# EasyEDA Pro project ProProject_魔方机器人7阶_2024-08-02.epro

# Schematic 树莓派gpio拓展版
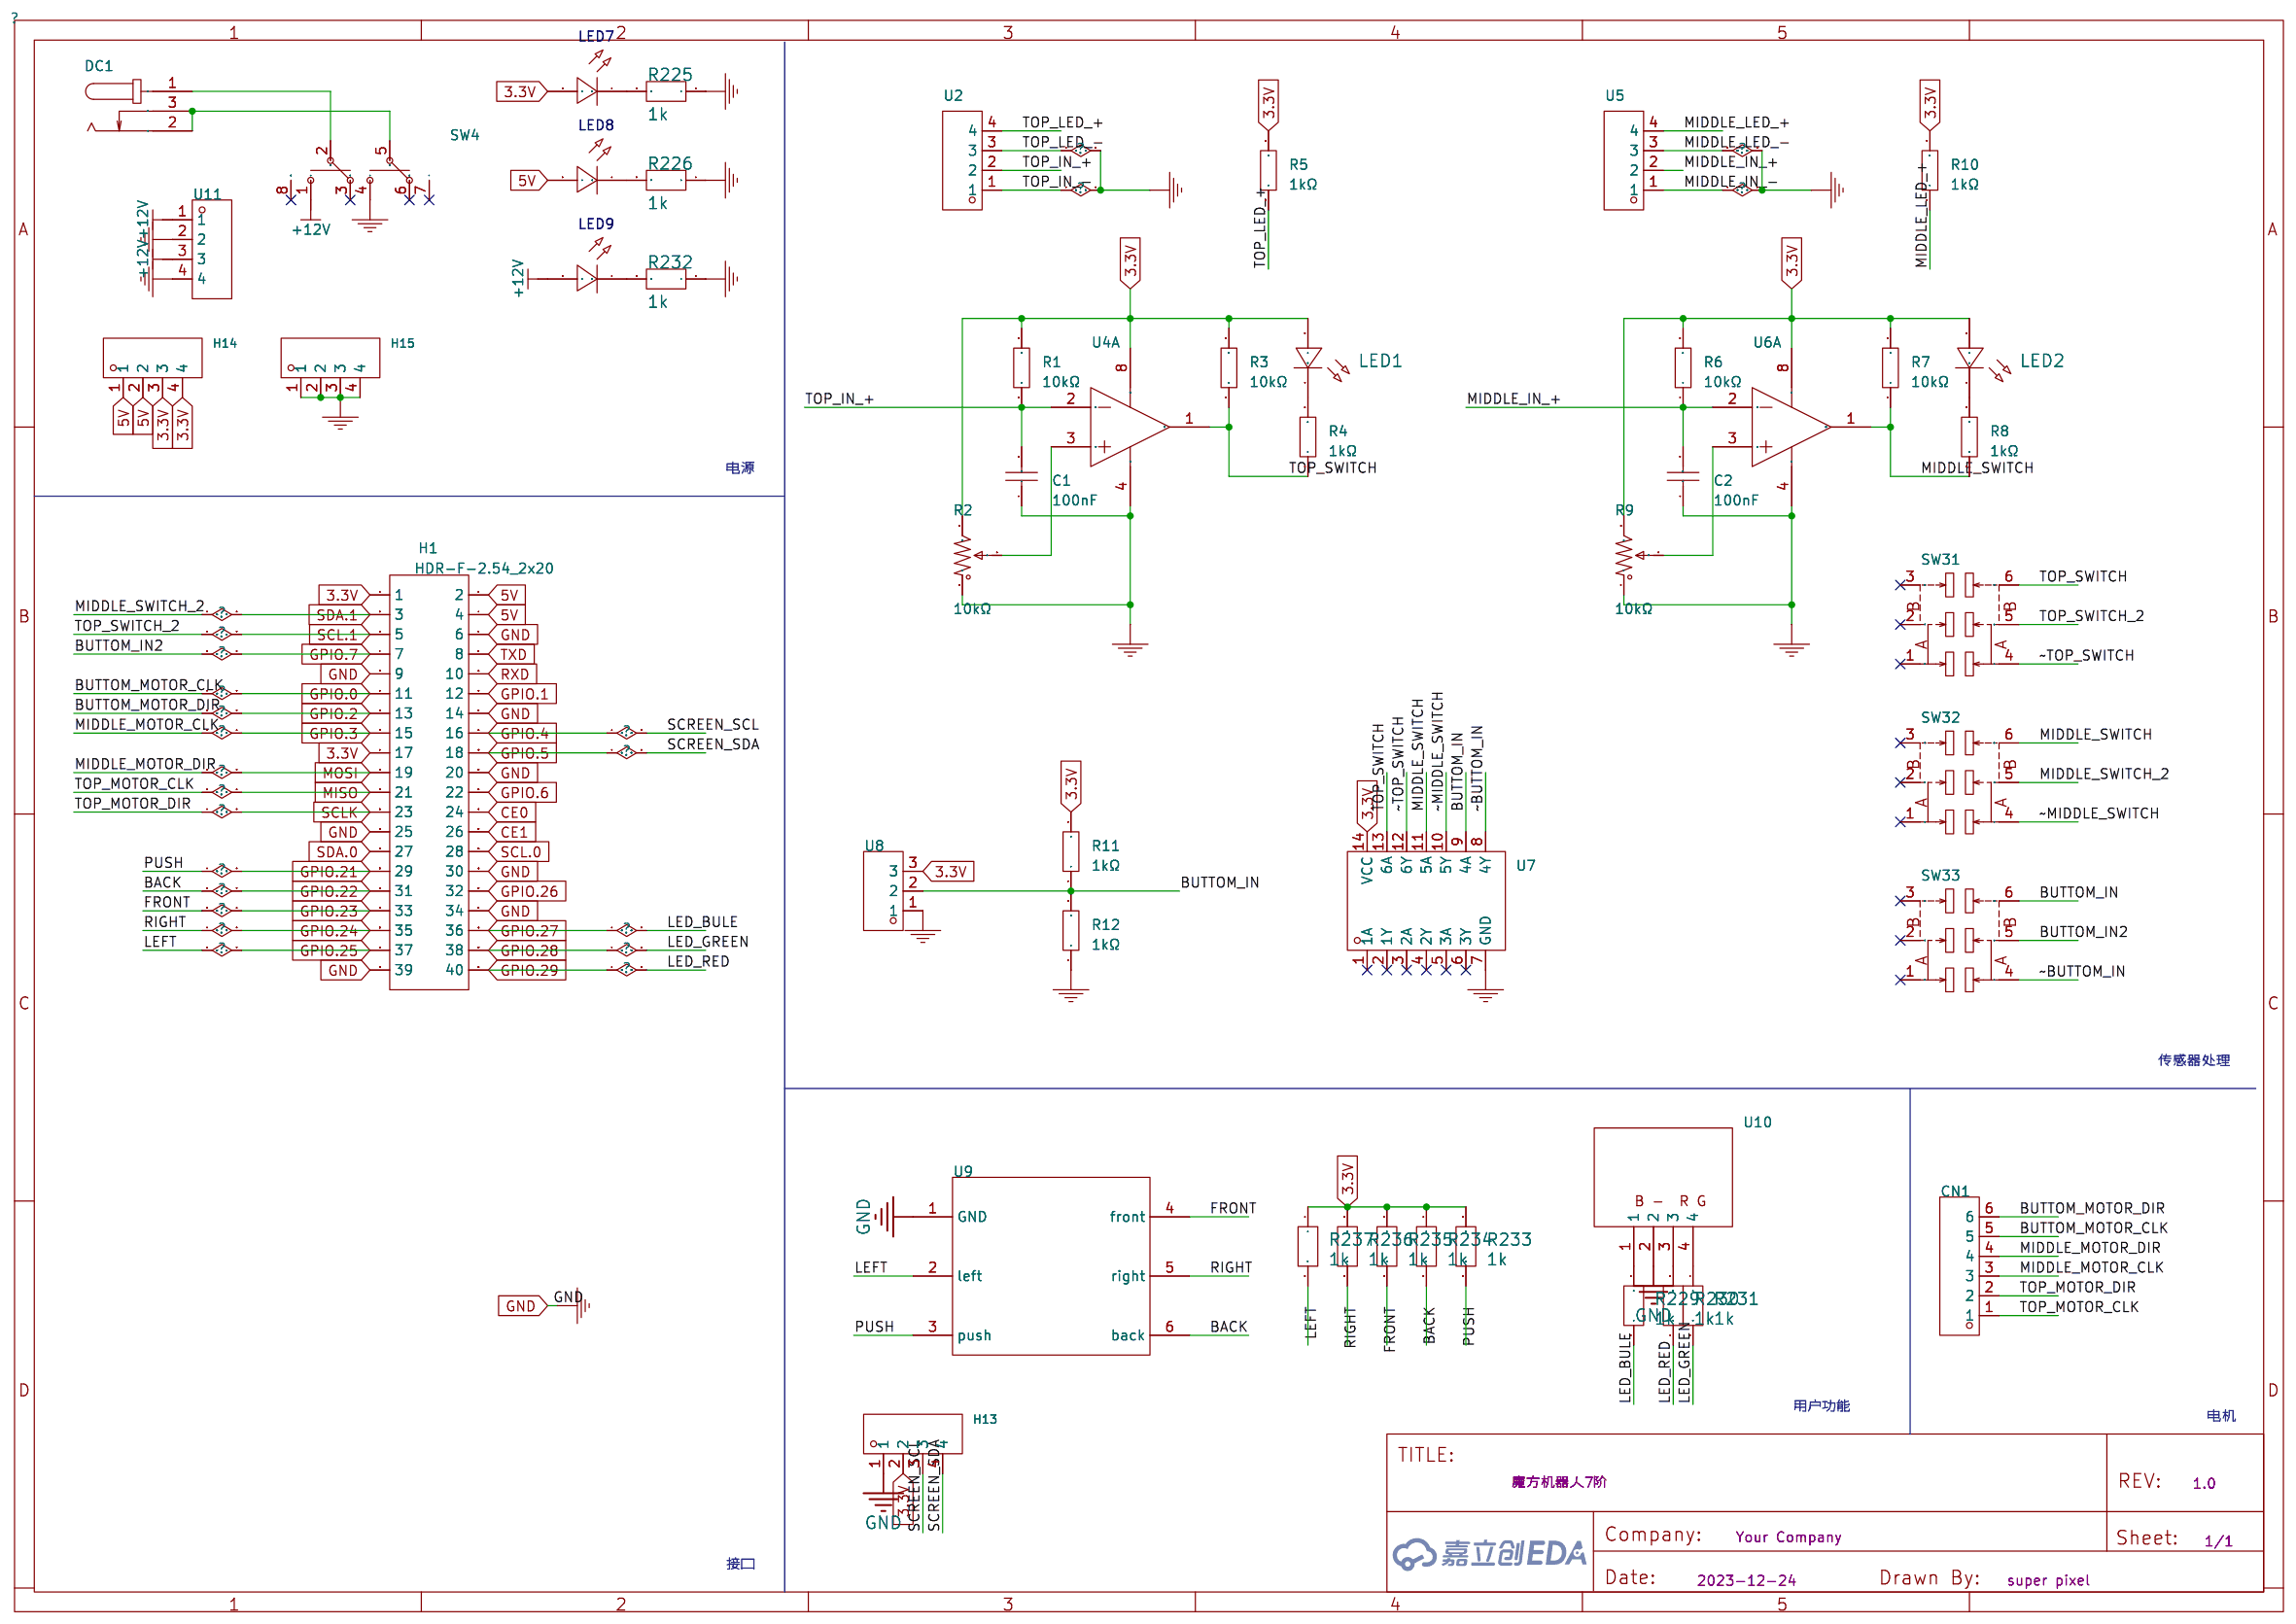
[diagram p0: schematic sheet]

## Parts
C1  100nF  [C0603]
C2  100nF  [C0603]
CN1  DB128V-5.08-6P-GN-S  [CONN-TH_6P-P5.08_DIBO_DB128V-5.08]
DC1  DC-005-5A-2.5  [DC-IN-TH_DC-005-5A-2.5]
H1  HDR-F-2.54_2x20  [HDR-F-2.54_2X20]
H13  -  [HDR-TH_4P-P2.54-V-M]
H14  -  [HDR-TH_4P-P2.54-V-M]
H15  -  [HDR-TH_4P-P2.54-V-M]
LED1  -  [LED_0603]
LED2  -  [LED_0603]
LED7  -  [LED_0805]
LED8  -  [LED_0805]
LED9  -  [LED_0805]
R1  10kΩ  [R0603]
R2  10kΩ  [RES-ADJ-TH_3362P]
R3  10kΩ  [R0603]
R4  1kΩ  [R0603]
R5  1kΩ  [R0603]
R6  10kΩ  [R0603]
R7  10kΩ  [R0603]
R8  1kΩ  [R0603]
R9  10kΩ  [RES-ADJ-TH_3362P]
R10  1kΩ  [R0603]
R11  1kΩ  [R0603]
R12  1kΩ  [R0603]
R225  1k  [R0805]
R226  1k  [R0805]
R229  1k  [R0805]
R230  1k  [R0805]
R231  1k  [R0805]
R232  1k  [R0805]
R233  1k  [R0805]
R234  1k  [R0805]
R235  1k  [R0805]
R236  1k  [R0805]
R237  1k  [R0805]
SW4  2MD3T2B1M6RES  [SW-TH_2MD3T2B1M6RES]
SW31  MST22D18G2  [SW-SMD_MST22D18G2]
SW32  MST22D18G2  [SW-SMD_MST22D18G2]
SW33  MST22D18G2  [SW-SMD_MST22D18G2]
U2  DB127V-5.0-4P-GN-S  [CONN-TH_4P-P5.00_DB127V-5.0-4P-GN-S]
U4  LM358  [SOP-8_L4.9-W3.9-P1.27-LS6.0-BL]  (section 1)
U5  DB127V-5.0-4P-GN-S  [CONN-TH_4P-P5.00_DB127V-5.0-4P-GN-S]
U6  LM358  [SOP-8_L4.9-W3.9-P1.27-LS6.0-BL]  (section 1)
U7  XL74LS04  [SOP-14_L8.6-W3.9-P1.27-LS6.0-BL]
U8  XY128V-A-5.08-3P  [CONN-TH_XY128V-A-5.08-3P]
U9  -  [直插五向开关]
U10  -  [直插rgb]
U11  DB127V-5.0-4P-GN-S  [CONN-TH_4P-P5.00_DB127V-5.0-4P-GN-S]

## Library data of the parts
C1 C2 = 0603B104K500NT: 容值:100nF;精度:±10%;额定电压:50V;材质(温度系数):X7R;; LCSC Part Name: 100nF ±10% 50V; Supplier Part: C30926; Manufacturer: FH(风华); Supplier Footprint: 0603; JLCPCB Part Class: 扩展库; Datasheet: https://atta.szlcsc.com/upload/public/pdf/source/20200305/C486355_26A10D38EF8C2A5C37091D0039909270.pdf; Supplier: LCSC; Tolerance: ±10%; Voltage Rated: 50V; Temperature Coefficient: X7R
CN1 = DB128V-5.08-6P-GN-S: 间距:5.08mm;结构:1x6P;安装方式:直插;排数:1;额定电流:20A;额定电压:300V;线规 - AWG:12~30;线规 - mm2:2.5;工作温度范围:-40℃~+105℃;颜色:绿色;每排PIN数:6;; LCSC Part Name: 5.08mm 1x6P 排数:1 每排P数:6 直插; Supplier Part: C2915642; Manufacturer: DORABO(地博电气); Supplier Footprint: 插件,P=5.08mm; JLCPCB Part Class: 扩展库; Datasheet: https://atta.szlcsc.com/upload/public/pdf/source/20230106/CC449C10514519CDCE20F1C37DBF2DAC.pdf; Supplier: LCSC; Pitch: 5.08mm; Structure: 1x6P; Mounting Style: 直插; Number of Pins: 6P; Number of Rows: 1; Current Rating (Max): 20A; Voltage Rating (Max): 300V; Wire Gauge - AWG: 12~30; Wire Gauge - mm2: 2.5; Operating Temperature Range: -40℃~+105℃; Color: 绿色; Number of PINs Per Row: 6
DC1 = DC-005-5A-2.5: 连接器类型:DC电源插座;触点内径:2.5mm;触点外径:6.5mm;额定电流:5A;额定电压:24V;触头材质:黄铜;工作温度范围:-20℃~+70℃;焊接温度(最大值):260℃;; LCSC Part Name: DC电源插座 内径:2.5mm 外径:6.5mm; Supplier Part: C381115; Manufacturer: XKB Connectivity(中国星坤); Supplier Footprint: 插件; JLCPCB Part Class: 扩展库; Datasheet: https://atta.szlcsc.com/upload/public/pdf/source/20220930/9F6B678D272419D8FE16D336E354A545.pdf; Supplier: LCSC; Connector Type: DC电源插座; Inside Contact Diameter: 2.5mm; Outside Contact Diameter: 6.5mm; Current Rating (Max): 5A; Voltage Rating (Max): 24V; Contact Material: 黄铜; Operating Temperature Range: -20℃~+70℃; Welding Temperature (Max): 260℃
H1 = HDR-F-2.54_2x20: Supplier Part: C50982; Supplier: LCSC
H13-H15 = HDR-M_2.54_1x4P: Supplier Part: C492403; Supplier Footprint: 插件
LED1 LED2 = LED_0603-R: Supplier Footprint: 0603
LED7-LED9 = LED_0805-G: Supplier Footprint: 0805
R1 R3 R6 R7 = 0603WAF1002T5E: 阻值:10kΩ;精度:±1%;功率:100mW;温度系数:±100ppm/℃;电阻类型:厚膜电阻;; LCSC Part Name: 10kΩ ±1% 100mW 厚膜电阻; Supplier Part: C25804; Manufacturer: UNI-ROYAL(厚声); Supplier Footprint: 0603; JLCPCB Part Class: Basic Part; Datasheet: https://atta.szlcsc.com/upload/public/pdf/source/20200306/C422600_1E6D84923E4A46A82E41ADD87F860B5C.pdf; Supplier: LCSC; Tolerance: ±1%; Power(Watts): 100mW; Overload Voltage (Max): 75V; Temperature Coefficient: ±100ppm/℃; Type: 厚膜电阻; Operating Temperature Range: -55℃~+155℃
R2 R9 = 3362P-1-103: 阻值:10kΩ;精度:±10%;; LCSC Part Name: 10kΩ ±10%; Supplier Part: C118956; Manufacturer: BOCHEN(博晨); Supplier Footprint: 插件; JLCPCB Part Class: 扩展库; Datasheet: https://atta.szlcsc.com/upload/public/pdf/source/20171114/C118956_15106326650691117445.pdf; Supplier: LCSC; Tolerance: ±10%
R4 R5 R8 R10-R12 = 0603WAF1001T5E: 阻值:1kΩ;精度:±1%;功率:100mW;温度系数:±100ppm/℃;电阻类型:厚膜电阻;; LCSC Part Name: 1kΩ ±1% 100mW 厚膜电阻; Supplier Part: C21190; Manufacturer: UNI-ROYAL(厚声); Supplier Footprint: 0603; JLCPCB Part Class: Basic Part; Datasheet: https://atta.szlcsc.com/upload/public/pdf/source/20200306/C422600_1E6D84923E4A46A82E41ADD87F860B5C.pdf; Supplier: LCSC; Tolerance: ±1%; Power(Watts): 100mW; Overload Voltage (Max): 75V; Temperature Coefficient: ±100ppm/℃; Type: 厚膜电阻; Operating Temperature Range: -55℃~+155℃
R225 R226 R229-R237 = 1k
SW4 = 2MD3T2B1M6RES: 电路结构:双刀双掷;机械寿命:30000;钮柄形状:圆柱钮柄;引脚样式:PC引脚;安装方式:弯插;工作温度:-40℃~+85℃;; LCSC Part Name: 2M系列 钮子开关 摇头开关; Supplier Part: C545196; Manufacturer: Dailywell(德利威); Supplier Footprint: 插件; JLCPCB Part Class: Extended Part; Datasheet: https://atta.szlcsc.com/upload/public/pdf/source/20200324/C496170_954A7394085DEA4CF4EC9443DF401EBE.pdf; Supplier: LCSC; Circuit: 双刀双掷; Mechanical Life: 30000; Actuator Type: 圆柱钮柄; Pin Style: PC引脚; Mounting Style: 弯插; Operating Temperature: -40℃~+85℃
SW31-SW33 = MST22D18G2: 额定电流(DC)：50mA 额定电压(DC)：12V 电路结构：单刀双掷 安装方式：立贴 机械寿命：10000 滑钮形状：矩形柱状 引脚样式：SMD接片 工作温度：-30℃~+80℃ 开关长度：9.1mm 开关宽度：3.6mm 开关高度：3.45mm 柄高：2mm; LCSC Part Name: 两档立式贴片 6脚拨动 柄长2.0MM; Supplier Part: C431544; Manufacturer: SHOU HAN(首韩); Supplier Footprint: SMD,3.6x9.1mm; JLCPCB Part Class: 扩展库; Datasheet: https://atta.szlcsc.com/upload/public/pdf/source/20190925/C431544_D32DFFD935A96A6C5145903882D4ABA1.pdf; Supplier: LCSC
U2 U5 U11 = DB127V-5.0-4P-GN-S: 间距:5mm;结构:1x4P;排数:1;每排PIN数:4;安装方式:直插;额定电流:15A;额定电压:250V;线规 - AWG:14~26;线规 - mm2:1.5;工作温度范围:-40℃~+105℃;颜色:绿色;; LCSC Part Name: 5mm 1x4P 排数:1 每排P数:4 直插; Supplier Part: C430624; Manufacturer: DIBO(地博电气); Supplier Footprint: 插件,P=5mm; JLCPCB Part Class: 扩展库; Datasheet: https://atta.szlcsc.com/upload/public/pdf/source/20230106/9CDB472D403F670588C42D375AEF1B30.pdf; Supplier: LCSC; Pitch: 5mm; Structure: 1x4P; Number of Rows: 1; Number of PINs Per Row: 4; Mounting Style: 直插; Current Rating (Max): 15A; Voltage Rating (Max): 250V; Wire Gauge - AWG: 14~26; Wire Gauge - mm2: 1.5; Operating Temperature Range: -40℃~+105℃; Color: 绿色; Number of Pins: 4P
U4 U6 = LM358_C5252902: 放大器数:双路;输入失调电压(Vos):5mV;输入偏置电流(Ib):50nA;增益带宽积(GBP):1.2MHz;; LCSC Part Name: 增益带宽(GBP):1.2MHz VIO:5mV  LM358; Supplier Part: C5252902; Manufacturer: MSKSEMI(美森科); Supplier Footprint: SOP-8; JLCPCB Part Class: Extended Part; Datasheet: https://atta.szlcsc.com/upload/public/pdf/source/20221111/EFA130B3B4599AE68A453AC9B85C4BC9.pdf; Supplier: LCSC; Number of Circuits: 双路; Supply Voltage: 3V~36V; Voltage - Input Offset(Vos): 5mV; Current - Input Bias(Ib): 50nA; Gain Bandwidth Product(GBP): 1.2MHz; Common Mode Rejection Ratio (CMRR): 80dB; Supply Current: 300uA; Operating Temperature: 0℃~+70℃
U7 = XL74LS04: 六路反向器; LCSC Part Name: 变换器; Supplier Part: C513511; Manufacturer: XINLUDA(信路达); Supplier Footprint: SOP-14; JLCPCB Part Class: Extended Part; Datasheet: https://atta.szlcsc.com/upload/public/pdf/source/20200414/C513511_4295B1BB66C5B6360CE522C95F4B27FF.pdf; Supplier: LCSC
U8 = XY128V-A-5.08-3P: 结构:1x3P;间距:5.08mm;颜色:绿色;安装方式:直插;额定电流:15A;额定电压:300V;排数:1;线规 - AWG:12~24;线规 - 平方毫米:2.5;每排PIN数:3;工作温度范围:-;; LCSC Part Name: 5.08mm 1x3P 排数:1 每排P数:3 直插; Supplier Part: C557666; Manufacturer: XINLAIYA(新莱亚); Supplier Footprint: 插件,P=5.08mm; JLCPCB Part Class: Extended Part; Datasheet: https://atta.szlcsc.com/upload/public/pdf/source/20200527/C557663_965673E12F0DA50AFE0C050081E55359.pdf; Supplier: LCSC; Structure: 1x3P; Pitch: 5.08mm; Color: 绿色; Mounting Style: 直插; Current Rating (Max): 15A; Voltage Rating (Max): 300V; Number of Pins: 3P; Number of Rows: 1; Wire Gauge - AWG: 12~24; Wire Gauge - mm2: 2.5; Number of PINs Per Row: 3
U9 = 直插五向开关
U10 = 直插RGB

## Nets
3.3V: H1.1 H1.17 H13.2 H14.3 H14.4 LED1.2(A) LED2.2(A) LED7.2(A) R1.2 R2.3 R3.2 R5.2 R6.2 R7.2 R9.3 R10.2 R11.2 R233.1 R234.1 R235.1 R236.1 R237.1 U4.8(VCC) U6.8(VCC) U7.14(VCC) U8.3
5V: H1.2 H1.4 H14.1 H14.2 LED8.2(A)
+12V: LED9.2(A) SW4.1 U11.1 U11.3
GND: C1.1 C2.1 H1.6 H1.9 H1.14 H1.20 H1.25 H1.30 H1.34 H1.39 H13.1 H15.1 H15.2 H15.3 H15.4 R2.1 R9.1 R12.1 R225.1 R226.1 R232.1 SW4.4 U2.1 U2.3 U4.4(VEE) U5.1 U5.3 U6.4(VEE) U7.7(GND) U8.1 U9.1(GND) U10.2 U11.2 U11.4
BACK: H1.31 R234.2 U9.6(back)
BUTTOM_IN: R11.1 R12.2 SW33.6 U7.9(4A) U8.2
BUTTOM_IN2: H1.7 SW33.5
BUTTOM_MOTOR_CLK: CN1.5 H1.11
BUTTOM_MOTOR_DIR: CN1.6 H1.13
CE0: H1.24
CE1: H1.26
FRONT: H1.33 R235.2 U9.4(front)
GPIO.1: H1.12
GPIO.3: CN1.3 H1.15
GPIO.4: H1.16 H13.3
GPIO.5: H1.18 H13.4
GPIO.6: H1.22
GPIO.21: H1.29 R233.2 U9.3(push)
GPIO.24: H1.35 R236.2 U9.5(right)
GPIO.25: H1.37 R237.2 U9.2(left)
GPIO.26: H1.32
GPIO.27: H1.36 R229.1
GPIO.28: H1.38 R231.2
GPIO.29: H1.40 R230.1
MIDDLE_IN_+: C2.2 R6.1 U5.2 U6.2(IN1-)
MIDDLE_LED_+: R10.1 U5.4
MIDDLE_MOTOR_DIR: CN1.4 H1.19
MIDDLE_SWITCH: R7.1 R8.1 SW32.6 U6.1(OUT1) U7.11(5A)
MIDDLE_SWITCH_2: H1.3 SW32.5
MISO: CN1.1 H1.21
RXD: H1.10
SCL.0: H1.28
SCL.1: H1.5 SW31.5
SCLK: CN1.2 H1.23
SDA.0: H1.27
TOP_IN_+: C1.2 R1.1 U2.2 U4.2(IN1-)
TOP_LED_+: R5.1 U2.4
TOP_SWITCH: R3.1 R4.1 SW31.6 U4.1(OUT1) U7.13(6A)
TXD: H1.8
~BUTTOM_IN: SW33.4 U7.8(4Y)
~MIDDLE_SWITCH: SW32.4 U7.10(5Y)
~TOP_SWITCH: SW31.4 U7.12(6Y)
$1N2898: LED1.1(C) R4.2
$1N2946: R2.2 U4.3(IN1+)
$1N3443: LED2.1(C) R8.2
$1N3463: R9.2 U6.3(IN1+)
$1N4495: DC1.1 SW4.2
$1N4496: DC1.2 DC1.3 SW4.5
$1N4628: LED7.1(C) R225.2
$1N4630: LED8.1(C) R226.2
$1N4991: R229.2 U10.1
$1N4992: R230.2 U10.3
$1N4993: R231.1 U10.4
$1N5070: LED9.1(C) R232.2

Not connected (* = marked no-connect by the designer): SW4 3* 6* 7* 8*; SW31 1* 2* 3*; SW32 1* 2* 3*; SW33 1* 2* 3*; U7 1(1A)* 2(1Y)* 3(2A)* 4(2Y)* 5(3A)* 6(3Y)*

## Notes on the sheet
- 电源
- 传感器处理
- 用户功能
- 电机
- 接口

# Board 1-PCB_NEW_PCB
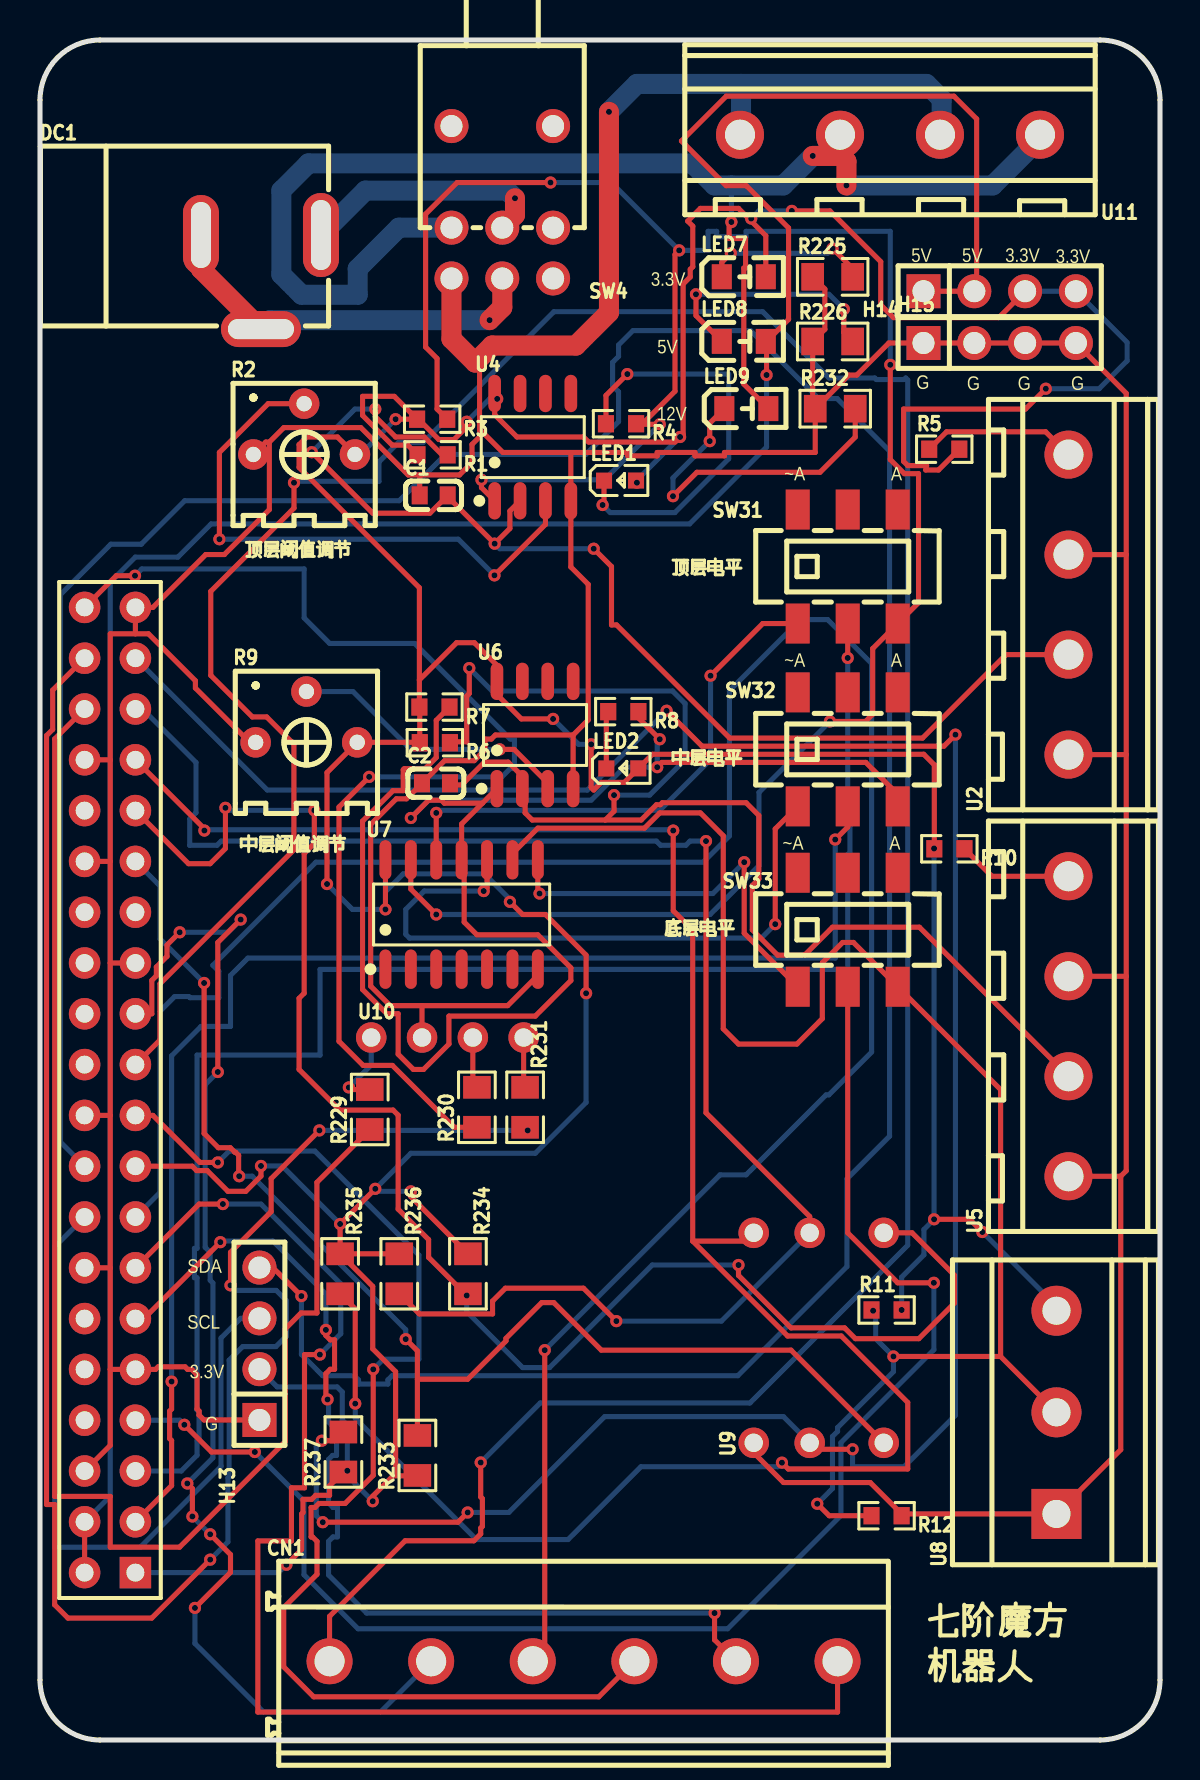
[diagram p1: board, top side]
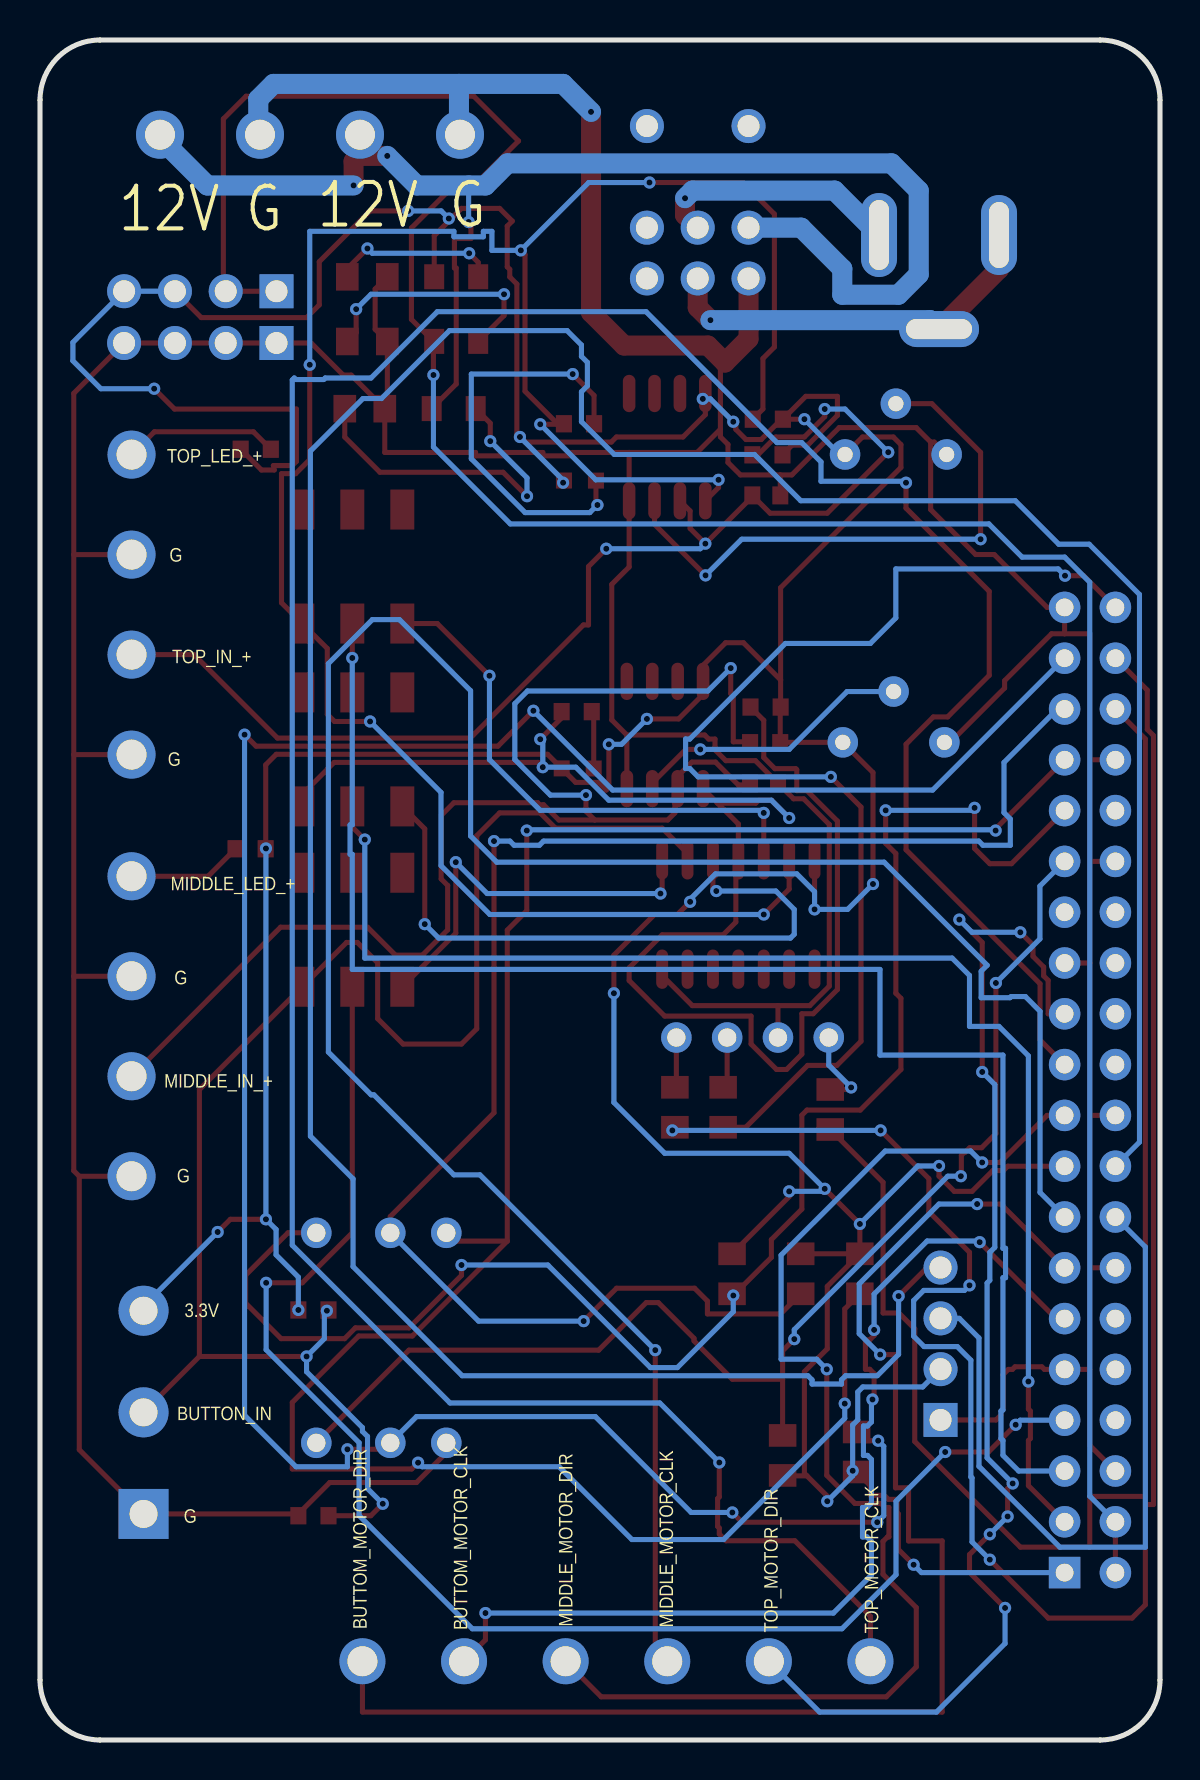
[diagram p2: board, bottom side, seen from below]

Outline 56 x 85 mm; copper layers: Top Layer, Bottom Layer. Coordinates in mm from the lower left corner of the outline.
Outline path: 0,82 arc(0.88,84.12) 3,85 53,85 arc(55.12,84.12) 56,82 56,3 arc(55.12,0.88) 53,0 3,0 arc(0.88,0.88) 0,3 0,82
Stack: Top Layer 0.035mm / Dielectric1 1.51mm FR4 er 4.5 / Bottom Layer 0.035mm

## Design rules (mm)
spacing Default (default): track to track 0.152, other pairs 0 to 0.152
track width Default (default): min 0.254, default 0.254, max 25.4
differential pair differentialPair (default): width min 0.127, default 0.254, max 2.54; gap min 0.152, default 0.152
via Default (default): diameter min 0.61, default 0.61, max 100.025; hole min 0.305, default 0.305, max 59.995

## Placement (name value [footprint] x y rotation side)
C1  100nF  [C0603]  19.69 62.23 0 top
C2  100nF  [C0603]  19.8 47.84 0 top
CN1  DB128V-5.08-6P-GN-S  [CONN-TH_6P-P5.08_DIBO_DB128V-5.08]  27.18 3.94 0 top
DC1  DC-005-5A-2.5  [DC-IN-TH_DC-005-5A-2.5]  11.05 72.9 0 top
H1  HDR-F-2.54_2x20  [HDR-F-2.54_2X20]  3.5 32.5 90 top
H13  -  [HDR-TH_4P-P2.54-V-M]  10.97 19.81 90 top
H14  -  [HDR-TH_4P-P2.54-V-M]  47.99 72.44 0 top
H15  -  [HDR-TH_4P-P2.54-V-M]  47.99 69.85 0 top
LED1  -  [LED_0603]  29.05 62.98 0 top
LED2  -  [LED_0603]  29.17 48.58 0 top
LED7  -  [LED_0805]  35.24 73.16 0 top
LED8  -  [LED_0805]  35.24 69.93 0 top
LED9  -  [LED_0805]  35.37 66.57 0 top
R1  10kΩ  [R0603]  19.63 64.26 180 top
R2  10kΩ  [RES-ADJ-TH_3362P]  13.21 65.55 0 top
R3  10kΩ  [R0603]  19.61 66.04 180 top
R4  1kΩ  [R0603]  29.05 65.81 180 top
R5  1kΩ  [R0603]  45.21 64.54 0 top
R6  10kΩ  [R0603]  19.74 49.86 180 top
R7  10kΩ  [R0603]  19.72 51.65 180 top
R8  1kΩ  [R0603]  29.16 51.42 180 top
R9  10kΩ  [RES-ADJ-TH_3362P]  13.32 51.15 0 top
R10  1kΩ  [R0603]  45.47 44.56 180 top
R11  1kΩ  [R0603]  42.33 21.5 0 top
R12  1kΩ  [R0603]  42.33 11.21 180 top
R225  1k  [R0805]  39.63 73.16 0 top
R226  1k  [R0805]  39.63 69.93 0 top
R229  1k  [R0805]  16.49 31.52 90 top
R230  1k  [R0805]  21.84 31.64 90 top
R231  1k  [R0805]  24.26 31.64 270 top
R232  1k  [R0805]  39.76 66.57 0 top
R233  1k  [R0805]  18.87 14.23 90 top
R234  1k  [R0805]  21.4 23.31 270 top
R235  1k  [R0805]  15.01 23.31 270 top
R236  1k  [R0805]  17.96 23.31 270 top
R237  1k  [R0805]  15.17 14.4 90 top
SW4  2MD3T2B1M6RES  [SW-TH_2MD3T2B1M6RES]  23.11 76.89 180 top
SW31  MST22D18G2  [SW-SMD_MST22D18G2]  40.39 58.67 0 top
SW32  MST22D18G2  [SW-SMD_MST22D18G2]  40.39 49.53 0 top
SW33  MST22D18G2  [SW-SMD_MST22D18G2]  40.39 40.51 0 top
U2  DB127V-5.0-4P-GN-S  [CONN-TH_4P-P5.00_DB127V-5.0-4P-GN-S]  51.42 56.77 90 top
U4  LM358  [SOP-8_L4.9-W3.9-P1.27-LS6.0-BL]  24.64 64.64 0 top
U5  DB127V-5.0-4P-GN-S  [CONN-TH_4P-P5.00_DB127V-5.0-4P-GN-S]  51.42 35.69 90 top
U6  LM358  [SOP-8_L4.9-W3.9-P1.27-LS6.0-BL]  24.75 50.25 0 top
U7  XL74LS04  [SOP-14_L8.6-W3.9-P1.27-LS6.0-BL]  21.08 41.28 0 top
U8  XY128V-A-5.08-3P  [CONN-TH_XY128V-A-5.08-3P]  50.82 16.38 90 top
U9  -  [直插五向开关]  35.69 14.86 90 top
U10  -  [直插rgb]  16.56 35.12 0 top
U11  DB127V-5.0-4P-GN-S  [CONN-TH_4P-P5.00_DB127V-5.0-4P-GN-S]  42.5 80.26 180 top

## Footprints (pads in the part's own frame, mm; a bottom-side part is the same pattern mirrored in y, then rotated)
C0603
  rect 0.8x0.9 smd: 1(-0.7,0) 2(0.7,0)
CONN-TH_4P-P5.00_DB127V-5.0-4P-GN-S
  round 2.4 hole 1.5: 1(-7.5,0) 2(-2.5,0) 3(2.5,0) 4(7.5,0)
CONN-TH_6P-P5.08_DIBO_DB128V-5.08
  round 2.3 hole 1.5: 1(-12.7,0) 2(-7.62,0) 3(-2.54,0) 4(2.54,0) 5(7.62,0) 6(12.7,0)
CONN-TH_XY128V-A-5.08-3P
  rect 2.5x2.5 hole 1.4: 1(-5.08,0)
  round 2.5 hole 1.4: 2(0,0) 3(5.08,0)
DC-IN-TH_DC-005-5A-2.5
  oval 1.8x4.2 hole 1x3.5: 1(3,2.352)
  oval 1.8x4 hole 1x3.3: 2(-3,2.352)
  oval 4x1.8 hole 3.3x1: 3(-0.001,-2.352)
HDR-F-2.54_2X20
  rect 1.575x1.575 hole 0.889: 1(-24.13,-1.27)
  round 1.575 hole 0.889: 2(-24.13,1.27) 3(-21.59,-1.27) 4(-21.59,1.27) 5(-19.05,-1.27) 6(-19.05,1.27) 7(-16.51,-1.27) 8(-16.51,1.27) 9(-13.97,-1.27) 10(-13.97,1.27) 11(-11.43,-1.27) 12(-11.43,1.27) 13(-8.89,-1.27) 14(-8.89,1.27) 15(-6.35,-1.27) 16(-6.35,1.27) 17(-3.81,-1.27) 18(-3.81,1.27) 19(-1.27,-1.27) 20(-1.27,1.27) 21(1.27,-1.27) 22(1.27,1.27) 23(3.81,-1.27) 24(3.81,1.27) 25(6.35,-1.27) 26(6.35,1.27) 27(8.89,-1.27) 28(8.89,1.27) 29(11.43,-1.27) 30(11.43,1.27) 31(13.97,-1.27) 32(13.97,1.27) 33(16.51,-1.27) 34(16.51,1.27) 35(19.05,-1.27) 36(19.05,1.27) 37(21.59,-1.27) 38(21.59,1.27) 39(24.13,-1.27) 40(24.13,1.27)
HDR-TH_4P-P2.54-V-M
  rect 1.7x1.7 hole 1.1: 1(-3.81,0)
  round 1.7 hole 1.1: 2(-1.27,0) 3(1.27,0) 4(3.81,0)
LED_0603
  rect 0.8x0.8 smd: 1(-0.851,-0.01) 2(0.75,-0.005)
LED_0805
  rect 1x1.25 smd: 1(-1.15,0.005) 2(1.05,0.005)
R0603
  rect 0.806x0.864 smd: 1(-0.753,0) 2(0.753,0)
R0805
  rect 1.133x1.377 smd: 1(-1,0) 2(1,0)
RES-ADJ-TH_3362P
  round 1.524 hole 0.762: 1(-2.54,-1.27) 2(0,1.27) 3(2.54,-1.27)
SOP-8_L4.9-W3.9-P1.27-LS6.0-BL
  oval 0.63x1.865 smd: 1(-1.905,-2.683) 2(-0.635,-2.683) 3(0.635,-2.683) 4(1.905,-2.683) 5(1.905,2.683) 6(0.635,2.683) 7(-0.635,2.683) 8(-1.905,2.683)
SOP-14_L8.6-W3.9-P1.27-LS6.0-BL
  oval 0.595x1.968 smd: 1(-3.81,-2.734) 2(-2.54,-2.734) 3(-1.27,-2.734) 4(0,-2.734) 5(1.27,-2.734) 6(2.54,-2.734) 7(3.81,-2.734) 8(3.81,2.734) 9(2.54,2.734) 10(1.27,2.734) 11(0,2.734) 12(-1.27,2.734) 13(-2.54,2.734) 14(-3.81,2.734)
SW-SMD_MST22D18G2
  rect 1.2x2 smd: 1(-2.5,2.85) 2(0,2.85) 3(2.5,2.85) 4(-2.5,-2.85) 5(0,-2.85) 6(2.5,-2.85)
SW-TH_2MD3T2B1M6RES
  round 1.7 hole 1.1: 1(2.54,1.27) 2(0,1.27) 3(-2.54,1.27) 4(2.54,3.81) 5(0,3.81) 6(-2.54,3.81) 7(2.54,-3.81) 8(-2.54,-3.81)
直插rgb
  round 1.524 hole 0.914: 1(0,0) 2(2.54,0) 3(5.08,0) 4(7.62,0)
直插五向开关
  round 1.524 hole 0.914: 1(0,0) 2(0,-2.8) 3(0,-6.5) 4(10.5,0) 5(10.5,-2.8) 6(10.5,-6.5)

## Nets
As in the schematic.

Pads without a net: SW4 3 6 7 8; SW31 1 2 3; SW32 1 2 3; SW33 1 2 3; U4 5 6 7; U6 5 6 7; U7 1 2 3 4 5 6

## Via types
v1: diameter 0.61, hole 0.305, Top Layer to Bottom Layer, 119 vias

## Routing (per net, layer and track width the routed paths; a pad name or vN(x,y) marks a point on that pad's centre or on a via; arc(x,y) is an arc through that point)
3.3V: length 298.1
  Top Layer w0.254: 18.97,53 18.97,57.61 12.95,63.63 12.95,64.77 13.34,65.15 14.87,65.15 R2.3 ; 18.97,53 20.83,54.86 21.72,54.86 22.85,53.73 U6.8 22.85,52.28 24.07,51.05 v1(25.65,51.05) ; 18.97,53 R7.2 18.99,51.63 R6.2 18.97,49.88 R9.3 14.35,48.37 v1(14.35,42.8) ; LED7.2 36.29,75.22 35.5,76.01 ; v1(11.05,28.7) 11.05,28.19 10.29,27.43 9.4,27.43 8.36,28.47 7.83,28.47 7.61,28.69 H1.17 ; R235.1 v1(15.01,25.8) v1(16.76,27.56) ; R235.1 16.64,22.68 16.64,19.56 17.78,18.41 17.78,13.34 17.65,13.21 ; R235.1 R236.1 ; v1(16.64,11.94) 16.64,12.19 17.65,13.21 ; 44.72,44.57 R10.2 ; 44.72,44.57 44.72,48.76 44.19,49.29 30.62,49.29 LED2.2 29.21,47.88 28.07,47.88 27.69,47.5 27.56,47.62 v1(27.56,49.78) ; 44.72,44.57 v1(44.7,44.58) ; R5.2 44.93,63.5 44.29,63.5 44.33,63.72 43.39,63.72 43.18,63.93 43.18,66.55 49.28,66.55 v1(50.29,67.56) ; LED1.2 29.8,62.91 v1(29.84,62.86) ; R234.1 18.54,27.17 v1(18.54,27.43) ; R3.2 18.92,66.04 19.94,65.02 20.7,65.02 21.21,65.53 21.21,65.79 v1(21.34,65.91) ; R3.2 v1(17.78,66.04) ; R3.2 17.71,67.18 16.13,67.18 16.13,66.23 17.61,64.75 18.39,64.75 R1.2 ; 35.5,76.01 34.93,76.58 33.02,76.58 32.38,75.95 32.64,75.69 32.64,73.66 32.51,73.53 32.51,73.15 32.16,72.8 32.16,65.3 v1(32,65.15) 31.75,64.9 27.43,64.9 27.18,65.15 23.85,65.15 22.73,66.27 U4.8 22.86,67.2 v1(22.86,67.06) ; 35.5,76.01 35.5,76.01 v1(35.56,76.07) ; v1(44.7,26.03) 46.48,26.03 v1(47.12,25.4) ; 17.65,13.21 18.85,13.21 R233.1 ; v1(15.37,13.46) 15.23,13.46 R237.1 14.48,12.71 14.48,12.23 13.78,12.23 13.58,12.03 13.15,12.03 13.15,11.37 13.08,11.3 13.08,9.53 v1(12.32,8.76) ; v1(27.31,37.34) 27.31,39.24 25.27,41.28 24.13,41.28 v1(23.5,41.91) ; v1(17.27,41.53) U7.14 ; v1(37.59,76.45) 39.5,76.45 42.04,73.91 42.04,71.75 42.67,71.12 47.94,71.12 H14.3
  Bottom Layer w0.254: v1(32,65.15) 29.84,62.99 v1(29.84,62.86) ; v1(11.05,28.7) 12.11,28.7 v1(15.01,25.8) ; v1(27.31,37.34) 27.31,31.88 24.76,29.34 18.54,29.34 v1(16.76,27.56) 16.89,27.43 v1(18.54,27.43) ; H13.2 11.86,17.65 14.86,17.65 15.11,17.4 15.11,16 15.37,15.75 v1(15.37,13.46) 15.37,13.21 v1(16.64,11.94) ; v1(37.59,76.45) 35.94,76.45 v1(35.56,76.07) ; H14.3 H14.4 54.36,69.88 54.36,68.96 52.96,67.56 v1(50.29,67.56) ; v1(14.35,42.8) 15.62,41.53 v1(17.27,41.53) 17.27,42.42 18.16,43.31 22.22,43.31 23.5,42.04 v1(23.5,41.91) ; v1(25.65,51.05) 26.92,49.78 v1(27.56,49.78) ; U8.3 50.82,21.69 v1(47.12,25.4) ; v1(43.08,21.5) 43.08,23.14 44.2,24.26 44.2,25.53 v1(44.7,26.03) v1(44.7,44.58) ; v1(22.86,67.06) 22.48,67.06 v1(21.34,65.91) ; v1(17.78,66.04) 16.02,64.28 R2.3 ; v1(12.32,8.76) 11.93,8.37 H1.1
5V: length 131.6
  Top Layer w0.254: v1(36.33,68.25) 36.33,69.93 ; 36.33,69.93 37.43,71.03 37.43,75.6 35.32,77.71 34.31,77.71 32.07,79.95 34.31,82.19 45.7,82.19 46.83,81.05 46.83,72.55 H14.2 H14.1 ; 36.33,69.93 LED8.2 ; H1.2 H1.4
  Bottom Layer w0.254: v1(36.33,68.25) 36.33,64.65 32.48,60.8 8.56,60.8 6.9,59.14 4.77,59.14 3.51,57.89 3.51,12.19 H1.4
+12V: length 70.8
  Top Layer w0.254: v1(34.57,75.9) 34.45,75.9 34.45,75.07 35.28,75.07 35.28,73.6 35.19,73.6 35.19,67.8 36.42,66.57
  Top Layer w1: v1(38.64,79.2) 40.04,79.2 ; 40.04,79.2 40.04,80.14 ; 40.04,79.2 40.32,78.93 v1(40.32,77.73)
  Bottom Layer w0.254: v1(34.57,75.9) 34.57,77.73
  Bottom Layer w1: v1(40.32,77.73) 47.64,77.73 50.04,80.14 ; v1(38.64,79.2) 37.16,77.73 33.72,77.73 32.62,78.83 13.43,78.83 12.06,77.47 12.06,73.28 13.08,72.26 15.89,72.26 15.89,73.56 17.94,75.62 SW4.1
GND: length 325.2
  Top Layer w0.254: R12.1 43.08,11.3 ; 43.08,11.3 41.51,12.87 37.17,12.87 35.69,14.36 U9.1 ; 43.08,11.3 U8.1 54.04,14.52 54.04,28.19 ; 54.31,59.27 U2.3 ; 54.31,59.27 54.31,49.27 ; 54.31,59.27 54.31,67.33 H15.4 H15.3 H15.2 H15.1 42.44,69.85 40.84,68.25 40.44,68.25 R232.1 ; 54.31,38.19 U5.3 ; 54.31,38.19 54.31,49.27 ; 54.31,38.19 54.31,28.46 54.04,28.19 ; 3.51,49.01 3.51,55.31 4.77,55.31 ; 3.51,49.01 3.51,43.93 ; 3.51,49.01 H1.34 ; 3.51,23.61 3.51,31.23 ; 3.51,23.61 3.51,18.53 ; 3.51,23.61 H1.14 ; 3.51,31.23 3.51,38.85 ; 3.51,31.23 H1.20 ; 3.51,38.85 3.51,43.93 ; 3.51,38.85 H1.25 ; 3.51,18.53 H1.9 5.78,18.53 5.91,18.66 7.25,18.66 7.38,18.53 7.58,18.53 7.85,18.26 7.85,16.55 7.95,16.45 7.95,16.25 8.2,16 H13.1 ; 3.51,18.53 3.51,14.73 H1.6 ; R225.1 39.24,72.55 39.24,70.53 R226.1 38.63,66.69 R232.1 ; U2.1 54.31,49.27 ; 18.99,63.25 18.41,63.25 16.04,65.62 12.19,65.62 11.47,64.9 ; 18.99,63.25 C1.1 ; 18.99,63.25 20.98,63.25 21.6,63.88 21.6,64.78 21.98,65.16 21.98,65.54 ; 11.47,64.9 11.47,61.52 9.22,59.27 8.29,59.27 5.65,56.63 H1.39 4.77,55.31 ; 11.47,64.9 11.29,64.9 R2.1 ; 19.1,36.72 U10.2 ; 19.1,36.72 23.38,36.72 24.89,38.23 24.89,38.54 ; 19.1,36.72 17.51,36.72 16.53,37.69 16.53,45.78 17.82,47.06 18.32,47.06 C2.1 20.23,48.97 21.71,48.97 22.25,49.51 22.25,50.05 22.57,50.05 22.77,50.25 26.66,50.25 ; R232.1 38.76,64.38 34.22,64.38 34.22,64.21 32.75,64.21 32.75,64.38 30.86,64.38 30.86,64.21 29.39,64.21 29.39,64.38 26.54,64.38 ; 26.54,64.38 23.14,64.38 21.98,65.54 ; 26.54,64.38 U4.4 26.54,58.65 27.41,57.78 27.41,51 26.66,50.25 ; 54.04,28.19 U5.1 ; 4.77,55.31 5.42,55.31 7.77,52.96 7.77,52.6 10.48,49.88 R9.1 ; 3.51,43.93 H1.30 ; 26.66,50.25 U6.4 ; 21.98,65.54 21.98,68.65 21.76,68.87
  Top Layer w1: v1(28.45,81.41) 28.45,71.37 26.8,69.72 22.61,69.72 21.76,68.87 20.57,70.06 SW4.4
  Bottom Layer w1: v1(28.45,81.41) 29.84,82.8 35.05,82.8 ; 35.05,82.8 35.05,80.32 U11.4 ; 35.05,82.8 44.32,82.8 45.09,82.04 45.09,80.35 U11.2
BACK: length 79
  Top Layer w0.254: U9.6 43.6,25.36 45.72,23.24 45.72,21.84 43.94,20.07 40.77,20.07 40.23,20.61 37.55,20.61 34.93,23.23 v1(34.93,23.75) ; v1(13.72,46.48) 13.72,44.83 13.21,44.32 13.21,37.34 12.95,37.08 12.95,33.53 14.99,31.5 17.65,31.5 17.91,31.24 17.91,26.54 19.43,25.02 19.43,24.13 v1(21.34,22.22) 21.34,22.25 R234.2 ; H1.31 7.42,43.81 8.51,43.81 9.27,44.58 v1(9.27,46.61)
  Bottom Layer w0.254: v1(9.27,46.61) 9.4,46.48 v1(13.72,46.48) ; v1(21.34,22.22) 21.34,21.41 24.13,18.62 25.48,18.62 30.61,23.75 v1(34.93,23.75)
BUTTOM_IN: length 80.2
  Top Layer w0.254: v1(41.66,21.46) 41.62,21.5 R11.1 ; 48.03,19.18 v1(42.67,19.18) ; 48.03,19.18 U8.2 ; 48.03,19.18 48.03,32.52 SW33.6 40.67,39.88 40.13,39.88 39.12,38.86 39.12,36.07 37.85,34.8 34.93,34.8 34.16,35.56 34.16,45.21 33.02,46.36 30.99,46.36 30.23,45.59 24.89,45.59 23.62,44.32 U7.9 ; R12.2 39.46,11.21 v1(38.86,11.81)
  Bottom Layer w0.254: v1(38.86,11.81) 39.62,12.57 39.62,15.18 39.88,15.43 39.88,15.62 42.67,18.41 v1(42.67,19.18) 41.78,20.07 41.78,21.34 v1(41.66,21.46)
BUTTOM_IN2: length 75.3
  Top Layer w0.254: SW33.5 40.39,25.36 42.88,22.86 v1(44.69,22.86) ; v1(7.22,15.76) 8.58,14.4 v1(10.74,14.4)
  Bottom Layer w0.254: H1.7 6.99,15.99 v1(7.22,15.76) ; v1(10.74,14.4) 13.2,11.94 13.2,8.26 15.9,5.56 34.38,5.56 40.04,11.22 40.04,14.87 44.69,19.51 v1(44.69,22.86)
BUTTOM_MOTOR_CLK: length 51.1
  Top Layer w0.254: v1(9.02,24.89) 5.19,21.07 H1.11 ; v1(14.38,17.03) 14.29,17.11 14.29,18.32 14.51,18.53 14.73,18.53 14.73,20.01 14.51,20.01 14.29,20.22 v1(14.29,20.51) ; v1(33.73,6.35) 33.73,5.01 CN1.5
  Bottom Layer w0.254: v1(14.29,20.51) 14.29,22.3 11.64,24.95 9.08,24.95 v1(9.02,24.89) ; v1(33.73,6.35) 16.33,6.35 14.43,8.25 14.43,9.93 14.65,10.15 14.88,10.15 14.88,11.63 14.65,11.63 14.43,11.85 14.43,14.03 14.63,14.23 14.83,14.23 14.83,15.7 14.63,15.7 14.43,15.9 14.43,16.98 v1(14.38,17.03)
BUTTOM_MOTOR_DIR: length 69.7
  Top Layer w0.254: v1(9.14,26.8) 7.96,26.8 H1.13 ; CN1.6 39.88,1.4 10.89,1.4 10.89,9.95 12.57,9.95 12.57,12.61 13.22,12.61 13.22,19.27 v1(13.99,19.27)
  Bottom Layer w0.254: v1(9.14,26.8) 11.05,26.8 15.04,22.81 15.04,20.32 v1(13.99,19.27)
FRONT: length 108.4
  Top Layer w0.254: 32.64,24.94 37.38,20.2 40.06,20.2 43.39,16.88 43.39,13.55 37.41,13.55 v1(37.1,13.87) ; 32.64,24.94 35.27,24.94 U9.4 ; 32.64,24.94 32.64,40.49 31.66,41.47 v1(31.66,45.47) ; H1.33 8.22,45.56 v1(8.22,45.47) ; v1(15.76,16.82) 15.76,21.55 R235.2
  Bottom Layer w0.254: v1(8.22,45.47) 8.26,45.51 31.62,45.51 v1(31.66,45.47) ; v1(15.76,16.82) 15.76,16.08 21.82,10.02 26.41,10.02 30.05,13.66 36.89,13.66 v1(37.1,13.87)
GPIO.3: length 118.8
  Top Layer w0.254: v1(25.24,19.49) 25.24,4.54 CN1.3
  Bottom Layer w0.254: H1.15 6,27.38 6,36.44 6.73,37.17 7.44,37.17 7.5,37.11 8.94,37.11 8.94,38.44 8.64,38.74 13.79,43.89 33.16,43.89 34.47,45.2 34.47,52.46 38.03,56.02 39.38,56.02 41.58,53.82 41.58,34.4 39.44,32.26 39.31,32.26 35.31,28.26 34,28.26 v1(25.24,19.49)
GPIO.4: length 35.9
  Bottom Layer w0.254: H1.16 0.73,24.65 0.73,9.64 5.01,9.64 9.05,13.68 9.05,20.1 10.03,21.08 H13.3
GPIO.5: length 158.8
  Top Layer w0.254: H13.4 11.64,23.62 v1(13.07,22.19)
  Bottom Layer w0.254: H1.18 1.03,29.89 1.03,57.28 3.54,59.79 5.06,59.79 7.24,61.96 17.96,61.96 20.28,64.28 27.29,64.28 28.93,65.92 28.93,67.41 28.63,67.71 28.63,68.88 28.93,69.18 28.93,69.75 29.65,70.47 35.53,70.47 38.92,67.07 39.85,67.07 42.48,64.45 42.48,30.19 40.35,28.06 40.35,23.67 34.89,18.21 17.61,18.21 17.4,18.01 17.4,17.8 15.93,17.8 15.93,18.01 15.72,18.21 14.13,18.21 13.07,19.28 v1(13.07,22.19)
GPIO.21: length 63.2
  Top Layer w0.254: 18.87,18.04 21.38,18.04 23.3,19.95 23.3,20.08 25.09,21.87 25.69,21.87 28.07,19.49 37.55,19.49 U9.3 ; 18.87,18.04 18.87,19.46 v1(18.29,20.04) ; 18.87,18.04 R233.2 ; v1(9.96,28.19) 9.93,28.22 9.93,29.24 9.78,29.39 9.74,29.39 9.52,29.61 8.92,29.61 8.21,30.33 v1(8.21,37.85)
  Bottom Layer w0.254: v1(8.21,37.85) 6.01,40.05 6.01,42.69 H1.29 ; v1(9.96,28.19) 10.61,28.19 18.29,20.52 v1(18.29,20.04)
GPIO.24: length 80.6
  Top Layer w0.254: v1(28.82,20.94) 27.17,22.59 23.27,22.59 22.63,21.95 22.63,21.3 18.97,21.3 R236.2 ; U9.5 38.49,26.17 33.3,31.36 v1(33.3,44.94)
  Bottom Layer w0.254: v1(33.3,44.94) 32.5,44.94 32.29,44.74 31.03,44.74 30.82,44.94 9.06,44.94 8.85,44.74 7.48,44.74 7.48,46.05 7.8,46.37 7.8,48.88 5.13,51.55 H1.35 ; U9.5 34.07,20.94 v1(28.82,20.94)
GPIO.25: length 122.4
  Top Layer w0.254: v1(45.77,50.27) 45.2,49.69 33.1,49.69 v1(31.33,51.46) ; v1(40.63,14.54) 38.81,14.54 U9.2 ; R237.2 14.74,14.97 v1(14.09,14.97) ; v1(14.14,10.89) 20.9,10.89 v1(21.38,11.38)
  Bottom Layer w0.254: H1.37 4.77,54.09 11.37,47.5 27.37,47.5 v1(31.33,51.46) ; v1(14.09,14.97) 13.81,14.69 13.81,11.22 v1(14.14,10.89) ; v1(45.77,50.27) 45.77,16.23 43.2,13.66 40.63,13.66 v1(40.63,14.54) ; U9.2 37.17,16.17 28.23,16.17 23.44,11.38 v1(21.38,11.38)
GPIO.27: length 74.1
  Top Layer w0.254: R229.1 13.85,27.88 13.85,21.35 13.05,21.35 12.26,20.56 12.26,14.93 6.98,9.64 3.51,9.64 3.51,12.18 0.73,12.18 0.73,50.05 H1.36
GPIO.28: length 96.6
  Top Layer w0.254: v1(24.38,30.48) 24.38,30.51 R231.2 ; v1(13.97,30.48) 11.56,28.07 11.56,26.42 9.53,24.38 v1(9.53,22.73) ; H1.38 0.64,52.5 0.64,50.53 0.33,50.22 0.33,11.77 0.73,11.77 0.73,6.76 1.4,6.1 5.59,6.1 v1(8.51,9.02)
  Bottom Layer w0.254: v1(8.51,9.02) 9.4,9.91 9.4,13.11 9.46,13.15 9.46,18.99 10.14,19.67 11.8,19.67 12.32,20.19 12.32,21.97 11.81,22.48 9.78,22.48 v1(9.53,22.73) ; v1(13.97,30.48) v1(24.38,30.48)
GPIO.29: length 58.7
  Top Layer w0.254: v1(4.75,58.21) 3.81,58.21 H1.40 ; R230.1 20.71,30.64 17.62,33.73 16.16,33.73 14.95,34.94 14.95,46.65 v1(16.46,48.16)
  Bottom Layer w0.254: v1(16.46,48.16) 23.09,48.16 23.51,48.58 23.72,48.58 23.72,50.05 23.51,50.05 18.73,54.83 14.48,54.83 13.21,56.1 13.21,58.55 5.09,58.55 v1(4.75,58.21)
MIDDLE_IN_+: length 69.3
  Top Layer w0.254: U5.2 43.97,40.64 39.62,40.64 38.23,39.24 36.88,39.24 35.62,40.51 35.62,42.73 35.94,43.05 35.94,46.23 35.31,46.86 31.12,46.86 31.01,46.76 30.82,46.76 30.06,46 28.26,46 ; 28.26,46 28.7,46.44 v1(28.7,47.24) ; 28.26,46 24.61,46 24.26,46.36 24.26,47.43 U6.2 24.12,48.18 23.41,48.89 22.22,48.89 21.08,47.75 20.58,47.75 C2.2 ; R6.1 20.54,49.91 21.34,49.91 21.34,52.2 21.46,52.32 v1(21.46,53.59)
  Bottom Layer w0.254: v1(28.7,47.24) 30.48,47.24 32.26,49.02 32.26,51.82 31.62,52.45 22.61,52.45 v1(21.46,53.59)
MIDDLE_LED_+: length 5.8
  Top Layer w0.254: R10.1 47.6,43.19 U5.4
MIDDLE_MOTOR_DIR: length 62
  Top Layer w0.254: CN1.4 27.94,2.16 13.68,2.16 12.19,3.66 12.19,6.62 13.85,8.29 13.85,9.93 13.63,10.15 13.55,10.15 13.55,11.63 13.75,11.63 13.95,11.83 15.26,11.83 16.66,13.23 v1(16.66,18.53) ; v1(8.89,28.88) 8,28.88 5.65,31.23 H1.19
  Bottom Layer w0.254: v1(8.89,28.88) 9.46,29.45 13.74,29.45 18.95,24.24 18.95,19.04 17.17,19.04 v1(16.66,18.53)
MIDDLE_SWITCH: length 81.2
  Top Layer w0.254: 22.12,46.84 U6.1 ; 22.12,46.84 21.08,45.8 U7.11 21.21,43.88 21.21,40.89 21.84,40.26 24.89,40.26 26.54,38.61 26.54,37.97 24.76,36.19 20.45,36.19 20.45,34.8 19.18,33.53 18.67,33.53 17.91,34.29 17.91,36.31 17.34,36.31 16.13,37.52 16.13,45.95 17.65,47.47 18.15,47.47 18.16,47.47 18.16,48.51 18.21,48.57 19.25,48.57 19.81,49.12 19.81,50.98 R7.1 ; 22.12,46.84 20.22,46.84 20.07,46.99 19.43,46.99 v1(18.54,46.1) ; v1(30.86,48.64) 31.1,48.88 41.29,48.88 42.89,47.28 SW32.6 ; v1(30.99,50.04) 29.92,51.11 R8.1
  Bottom Layer w0.254: v1(30.99,50.04) 30.86,49.91 v1(30.86,48.64) 29.21,48.64 27.56,46.99 19.43,46.99 v1(18.54,46.1)
MIDDLE_SWITCH_2: length 68.7
  Top Layer w0.254: SW32.5 40.39,45.65 v1(39.76,45.02) ; H1.3 6.58,12.72 6.58,14.97 6.48,15.07 6.48,16.45 6.58,16.55 v1(6.58,17.92)
  Bottom Layer w0.254: v1(6.58,17.92) 6.58,34.21 8.05,35.68 9.53,35.68 9.53,38.23 10.39,39.09 39.76,39.09 v1(39.76,45.02)
MISO: length 156.8
  Top Layer w0.254: v1(12.7,62.86) 12.7,61.59 8.54,57.43 8.54,53.23 10.62,51.15 11.33,51.15 12.7,49.79 12.7,44.51 6,37.81 6,35 H1.21 ; v1(22.03,13.88) 22.03,12.15 22.12,12.07 22.12,10.68 22.03,10.6 22.03,10.3 21.7,9.96 18.26,9.96 14.48,6.18 CN1.1
  Bottom Layer w0.254: v1(22.03,13.88) 25.01,16.85 35.5,16.85 43.39,24.74 43.39,68 43.29,68.1 43.21,68.02 41.81,68.02 41.74,68.1 39.45,68.1 36.13,71.42 25.7,71.42 19.15,64.87 17.92,64.87 16.95,63.9 16.95,62.94 12.77,62.94 v1(12.7,62.86)
SCL.1: length 78.1
  Top Layer w0.254: v1(40.39,54.1) SW31.5
  Bottom Layer w0.254: H1.5 7.06,13.45 7.85,14.24 7.85,14.97 7.95,15.07 7.95,16.45 7.9,16.5 7.85,16.5 7.85,23.11 7.72,23.11 7.72,24.58 7.85,24.58 7.85,34.25 14,34.25 14,38.53 40.39,38.53 40.39,44.29 40.5,44.29 40.5,45.76 40.39,45.76 v1(40.39,54.1)
SCLK: length 62.4
  Top Layer w0.254: v1(10.03,41.02) 8.89,39.88 v1(8.89,33.4) ; H1.23 5.59,36.31 5.59,37.98 5.82,38.21 5.82,38.65 6.35,39.18 6.35,39.75 v1(6.98,40.39) ; 8.51,10.16 v1(8.51,10.29) 9.53,9.27 9.53,8.38 v1(7.75,6.6) ; v1(7.37,12.83) 7.62,12.57 v1(7.62,11.18)
  Bottom Layer w0.254: v1(7.75,6.6) 7.75,4.83 11.18,1.4 17.02,1.4 CN1.2 ; v1(10.03,41.02) 9.4,40.39 v1(6.98,40.39) ; v1(7.37,12.83) 8.65,14.11 8.65,22.85 8.51,22.99 8.51,24.38 8.26,24.63 8.26,32.77 v1(8.89,33.4) ; v1(8.51,10.29) v1(7.62,11.18)
TOP_IN_+: length 59.5
  Top Layer w0.254: U4.2 23.5,61.45 23.5,60.58 v1(22.73,59.82) 20.38,62.17 C1.2 19.5,61.34 16.64,61.34 v1(13.59,64.39) ; R1.1 20.11,64.26 19.21,65.15 17.78,65.15 16.76,66.17 v1(16.76,66.55) ; U2.2 48.3,54.27 44.13,50.1 34.48,50.1 28.83,55.75 28.57,55.75 28.57,58.67 v1(27.69,59.56)
  Bottom Layer w0.254: v1(16.76,66.55) 15.75,66.55 v1(13.59,64.39) ; v1(22.73,59.82) 22.99,59.56 v1(27.69,59.56)
TOP_LED_+: length 7.8
  Top Layer w0.254: U2.4 50.28,65.41 45.33,65.41 R5.1
TOP_SWITCH: length 117
  Top Layer w0.254: v1(25.53,77.87) 20.86,77.87 19.28,76.3 19.28,69.65 19.85,69.07 19.85,66.55 R3.1 ; v1(39.5,50.93) 41.28,50.93 41.64,51.29 41.64,54.57 SW31.6 43.93,56.86 43.93,63.32 43.22,63.32 42.51,64.02 v1(42.51,68.76) ; U4.1 22.07,62.62 v1(22.07,63.01) ; v1(31.96,74.48) 31.75,74.27 31.75,67.44 30.12,65.81 ; 30.12,65.81 30.15,65.79 v1(30.99,65.79) ; 30.12,65.81 R4.1 ; U7.13 18.54,42.55 v1(19.81,41.28)
  Bottom Layer w0.254: v1(42.51,68.76) 42.51,75.43 35.3,75.43 35.3,75.16 33.83,75.16 33.83,75.43 33.41,75.43 33.41,74.48 v1(31.96,74.48) 28.57,77.87 v1(25.53,77.87) ; v1(19.81,41.28) 33.51,41.28 35.95,43.72 35.95,47.38 v1(39.5,50.93) ; v1(22.07,63.01) 28.21,63.01 v1(30.99,65.79)
~BUTTOM_IN: length 19.9
  Top Layer w0.254: v1(35.21,43.89) 35.21,40.34 SW33.4 ; v1(24.98,42.32) 24.89,42.41 U7.8
  Bottom Layer w0.254: v1(35.21,43.89) 33.64,42.32 v1(24.98,42.32)
~MIDDLE_SWITCH: length 32.3
  Top Layer w0.254: v1(36.76,40.79) 36.76,45.56 SW32.4 ; v1(22.19,42.45) 22.35,42.61 U7.10
  Bottom Layer w0.254: v1(22.19,42.45) 19.21,42.45 18.29,41.53 18.29,40.28 18.48,40.1 36.07,40.1 v1(36.76,40.79)
~TOP_SWITCH: length 26.8
  Top Layer w0.254: SW31.4 36.14,55.82 v1(33.53,53.21) ; v1(19.81,46.36) U7.12
  Bottom Layer w0.254: v1(19.81,46.36) 19.94,46.48 30.99,46.48 33.53,49.02 v1(33.53,53.21)
$1N2898: length 21.1
  Top Layer w0.254: R4.2 28.3,67.23 v1(29.37,68.3) ; LED1.1 28.2,61.82 v1(28.13,61.75)
  Bottom Layer w0.254: v1(28.13,61.75) 28.51,61.37 31.74,61.37 34.43,64.06 34.43,68.3 v1(29.37,68.3)
$1N2946: length 28.9
  Top Layer w0.254: v1(22.72,58.23) 25.27,60.78 U4.3 ; R2.2 11.41,66.82 8.97,64.38 v1(8.97,60.04)
  Bottom Layer w0.254: v1(22.72,58.23) 20.92,60.04 v1(8.97,60.04)
$1N3443: length 2.9
  Top Layer w0.254: 28.31,48.57 28.31,51.32 R8.2
$1N3463: length 14.2
  Top Layer w0.254: v1(22.99,49.53) 23.71,49.53 25.39,47.85 U6.3
  Bottom Layer w0.254: v1(22.99,49.53) 18.54,49.53 15.65,52.42 R9.2
$1N4495: length 12.5
  Top Layer w1: v1(23.75,77.09) 23.75,76.25 SW4.2
  Bottom Layer w1: DC1.1 16.27,77.47 23.37,77.47 v1(23.75,77.09)
$1N4496: length 19.9
  Top Layer w1: DC1.2 8.05,73.55 DC1.3 ; SW4.5 23.11,71.63 v1(22.48,70.99)
  Bottom Layer w1: v1(22.48,70.99) 11.5,70.99 DC1.3
$1N4628: length 8.4
  Top Layer w0.254: LED7.1 34.09,73.88 v1(34.54,74.34) ; R225.2 40.63,73.57 v1(39.63,74.58)
  Bottom Layer w0.254: v1(39.63,74.58) 39.39,74.34 v1(34.54,74.34)
$1N4630: length 12.4
  Top Layer w0.254: R226.2 40.19,70.37 v1(40.19,71.54) ; LED8.1 32.8,71.22 v1(32.8,72.29)
  Bottom Layer w0.254: v1(40.19,71.54) 39.45,72.29 v1(32.8,72.29)
$1N4991: length 4
  Top Layer w0.254: v1(15.44,32.63) 15.55,32.52 R229.2
  Bottom Layer w0.254: v1(15.44,32.63) 16.56,33.75 U10.1
$1N4992: length 2.6
  Top Layer w0.254: U10.3 21.64,32.84 R230.2
$1N4993: length 2.5
  Top Layer w0.254: R231.1 24.18,32.71 U10.4
$1N5070: length 17.2
  Top Layer w0.254: v1(31.65,62.19) 32.85,63.39 39,63.39 40.76,65.14 R232.2 ; v1(33.49,64.94) 33.49,65.84 34.22,66.57
  Bottom Layer w0.254: v1(33.49,64.94) 31.65,63.11 v1(31.65,62.19)

## Text on the board
Bottom Silkscreen Layer: G | 12V | 3.3V | BUTTON_IN | TOP_IN_+ | MIDDLE_LED_+ | TOP_LED_+ | MIDDLE_IN_+ | TOP_MOTOR_CLK | TOP_MOTOR_DIR | MIDDLE_MOTOR_CLK | MIDDLE_MOTOR_DIR | BUTTOM_MOTOR_CLK | BUTTOM_MOTOR_DIR
Top Silkscreen Layer: SDA | SCL | 3.3V | G | 中层阈值调节 | 顶层阈值调节 | 12V | 5V | 底层电平 | 顶层电平 | 中层电平 | ~A | A | 七阶魔方 / 机器人
